# Altium project DM1097_R1M1E1.PrjPcb (part 11 of 12)

## Sheet DM1097_Connector_A.SchDoc: =project_title
size Tabloid; CompanyName: Luxonis Holding; DrawnBy: David Malovrh; Organization: Luxonis Holding; Address1: 1925 Harmony Park Drive; Address2: Westminster, CO; Address3: 80234; Address4: United States; DocumentNumber: D0000200; Revision: R1M1E1; SheetNumber: 3; SheetTotal: 17
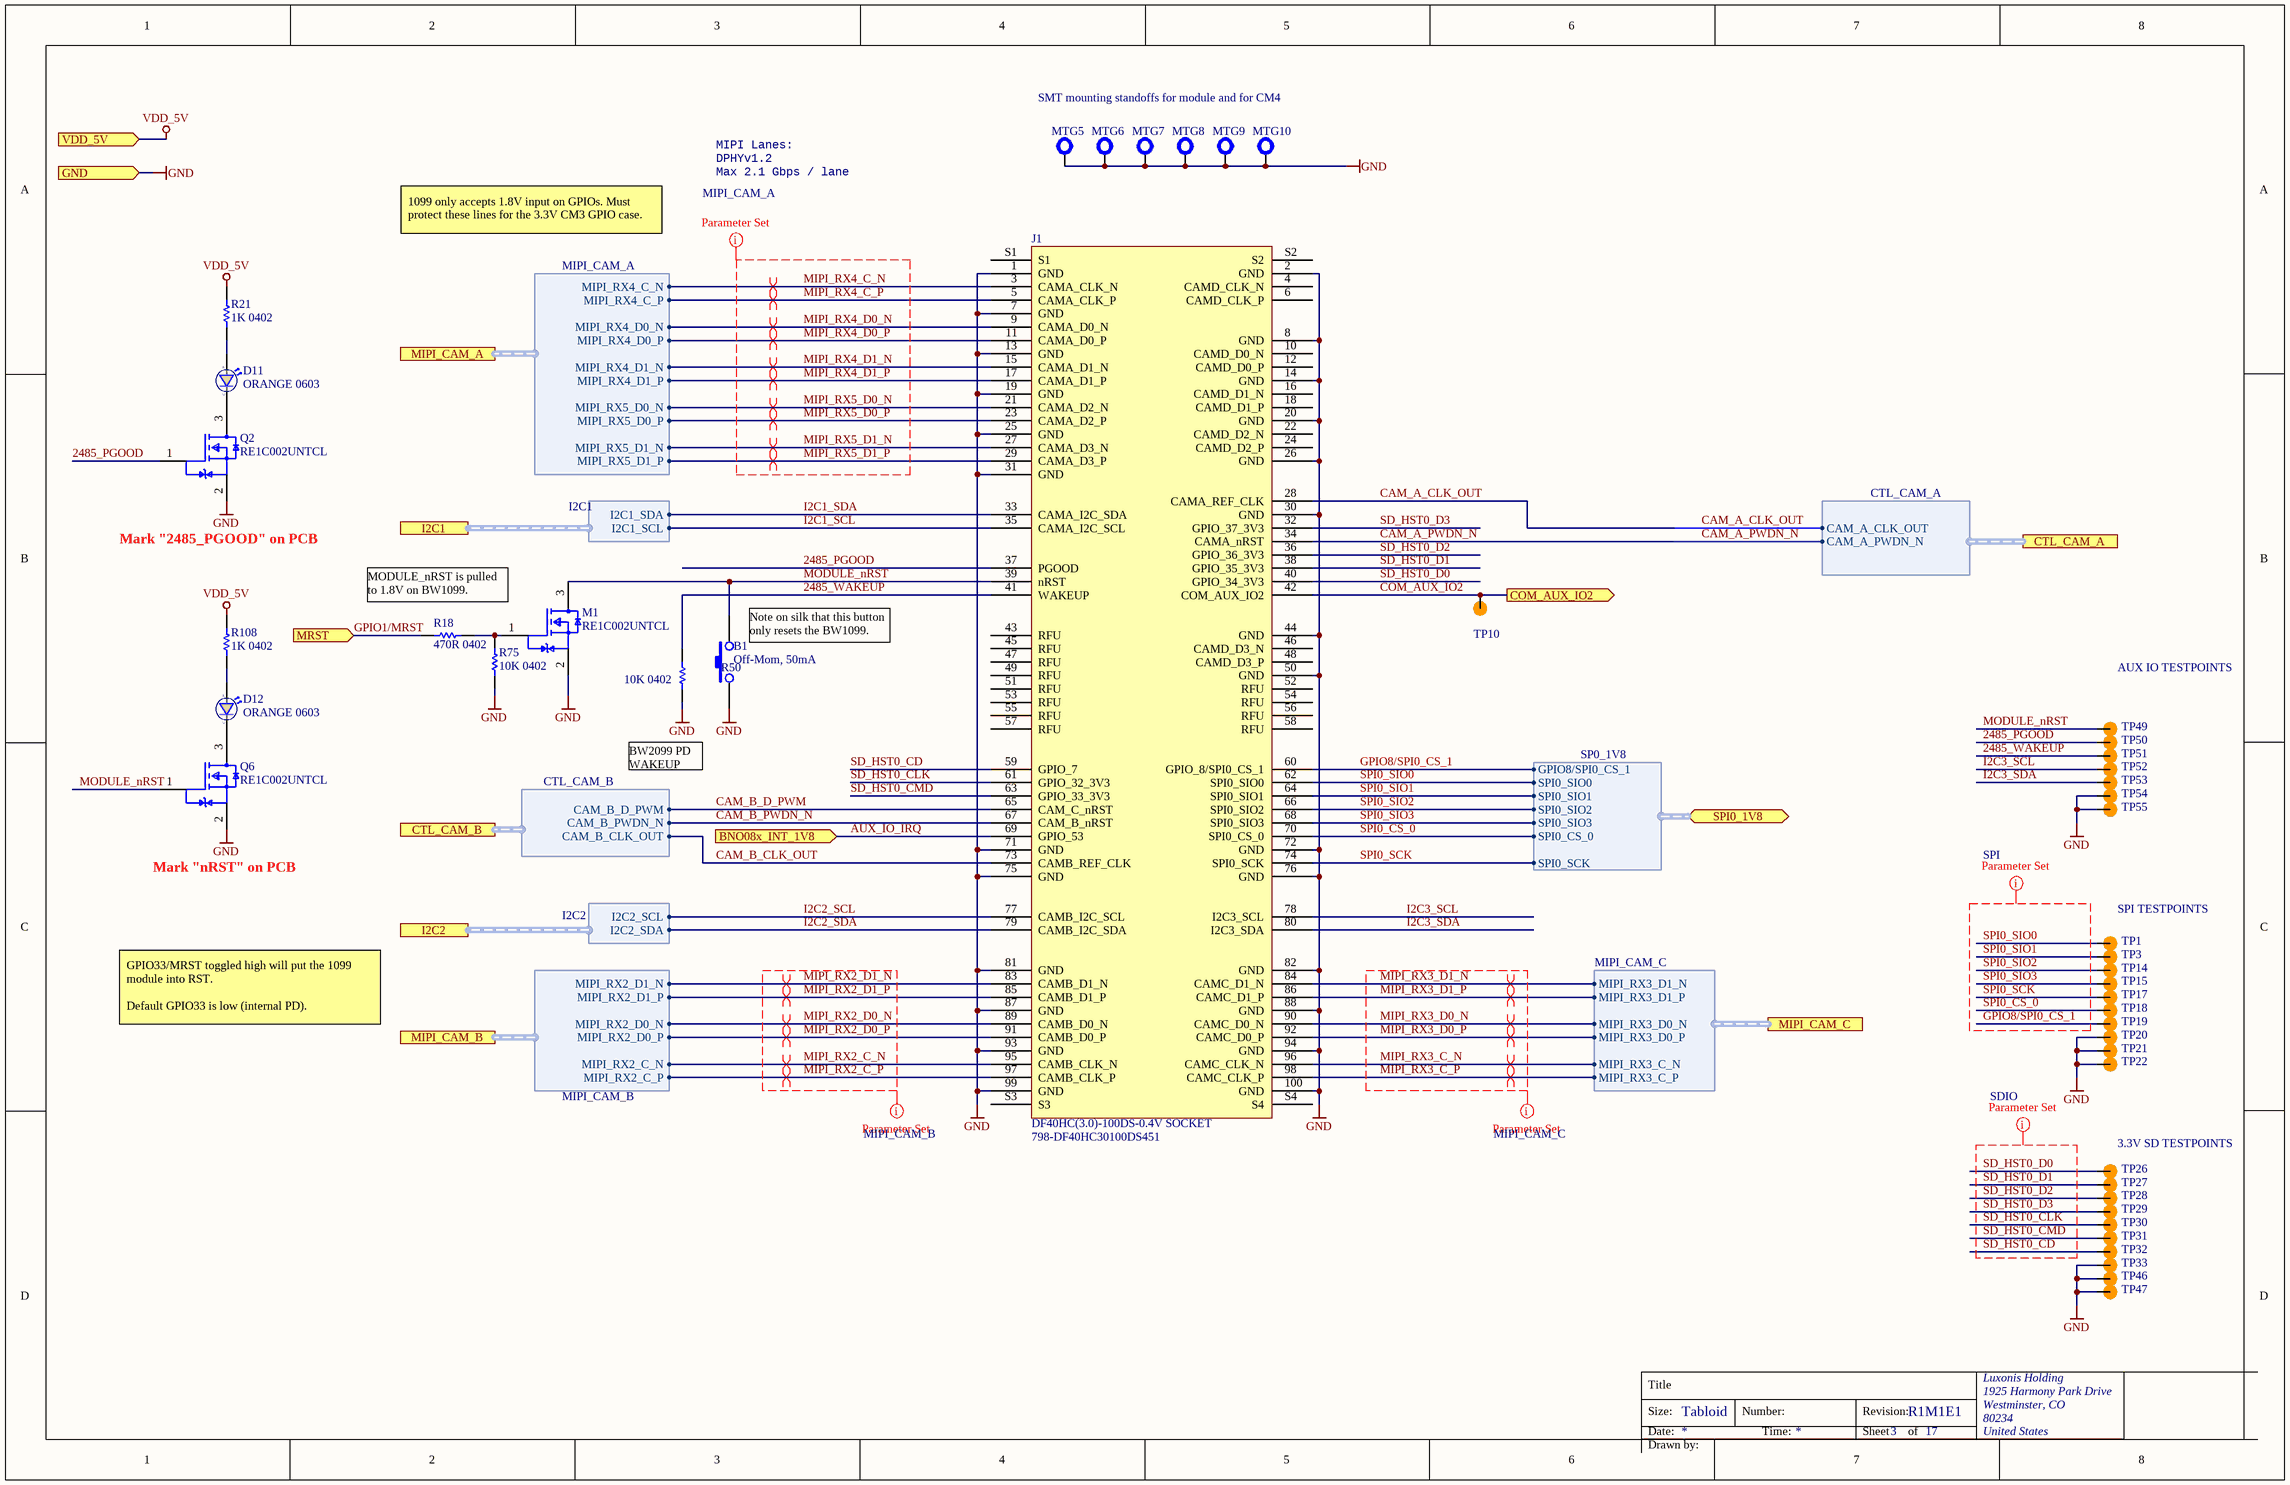
[diagram p15: DM1097_Connector_A.SchDoc]

### Parts
B1  Off-Mom, 50mA  [DTSM-32N-V]
D11  ORANGE 0603  [SML_D1xx8W]
D12  ORANGE 0603  [SML_D1xx8W]
J1  DF40HC(3.0)-100DS-0.4V SOCKET  Supplier Part Number 1: 798-DF40HC30100DS451  [DF40HC-3.0-100DS-0.4V_minpad]
M1  RE1C002UNTCL  [RE1C002UNTCL]
MTG5  M2, 3MM steel spacer on M2.5 mounting pad  [9774030943R]  (value not drawn)
MTG6  M2, 3MM steel spacer on M2.5 mounting pad  [9774030943R]  (value not drawn)
MTG7  M2, 3MM steel spacer on M2.5 mounting pad  [9774030943R]  (value not drawn)
MTG8  M2, 3MM steel spacer on M2.5 mounting pad  [9774030943R]  (value not drawn)
MTG9  M2, 3MM steel spacer on M2.5 mounting pad  [9774030943R]  (value not drawn)
MTG10  M2, 3MM steel spacer on M2.5 mounting pad  [9774030943R]  (value not drawn)
Q2  RE1C002UNTCL  [RE1C002UNTCL]
Q6  RE1C002UNTCL  [RE1C002UNTCL]
R18  470R 0402  [RESC0402(1005)_N]
R21  1K 0402  [RESC0402(1005)_L]
R50  10K 0402  [RESC0402(1005)_L]
R75  10K 0402  [RESC0402(1005)_N]
R108  1K 0402  [RESC0402(1005)_L]
TP1  TP100_200_NS  [TP100_200_NS]  (value not drawn)  (no BOM)
TP3  TP100_200_NS  [TP100_200_NS]  (value not drawn)  (no BOM)
TP10  TP100_200_NS  [TP100_200_NS]  (value not drawn)  (no BOM)
TP14  TP100_200_NS  [TP100_200_NS]  (value not drawn)  (no BOM)
TP15  TP100_200_NS  [TP100_200_NS]  (value not drawn)  (no BOM)
TP17  TP100_200_NS  [TP100_200_NS]  (value not drawn)  (no BOM)
TP18  TP100_200_NS  [TP100_200_NS]  (value not drawn)  (no BOM)
TP19  TP100_200_NS  [TP100_200_NS]  (value not drawn)  (no BOM)
TP20  TP100_200_NS  [TP100_200_NS]  (value not drawn)  (no BOM)
TP21  TP100_200_NS  [TP100_200_NS]  (value not drawn)  (no BOM)
TP22  TP100_200_NS  [TP100_200_NS]  (value not drawn)  (no BOM)
TP26  TP100_200_NS  [TP100_200_NS]  (value not drawn)  (no BOM)
TP27  TP100_200_NS  [TP100_200_NS]  (value not drawn)  (no BOM)
TP28  TP100_200_NS  [TP100_200_NS]  (value not drawn)  (no BOM)
TP29  TP100_200_NS  [TP100_200_NS]  (value not drawn)  (no BOM)
TP30  TP100_200_NS  [TP100_200_NS]  (value not drawn)  (no BOM)
TP31  TP100_200_NS  [TP100_200_NS]  (value not drawn)  (no BOM)
TP32  TP100_200_NS  [TP100_200_NS]  (value not drawn)  (no BOM)
TP33  TP100_200_NS  [TP100_200_NS]  (value not drawn)  (no BOM)
TP46  TP100_200_NS  [TP100_200_NS]  (value not drawn)  (no BOM)
TP47  TP100_200_NS  [TP100_200_NS]  (value not drawn)  (no BOM)
TP49  TP100_200_NS  [TP100_200_NS]  (value not drawn)  (no BOM)
TP50  TP100_200_NS  [TP100_200_NS]  (value not drawn)  (no BOM)
TP51  TP100_200_NS  [TP100_200_NS]  (value not drawn)  (no BOM)
TP52  TP100_200_NS  [TP100_200_NS]  (value not drawn)  (no BOM)
TP53  TP100_200_NS  [TP100_200_NS]  (value not drawn)  (no BOM)
TP54  TP100_200_NS  [TP100_200_NS]  (value not drawn)  (no BOM)
TP55  TP100_200_NS  [TP100_200_NS]  (value not drawn)  (no BOM)

### Ports
BNO08x_INT_1V8 (in), COM_AUX_IO2 (out), CTL_CAM_A (harness CTL_CAM_A), CTL_CAM_B (harness CTL_CAM_B), GND (in), I2C1 (harness I2C1), I2C2 (harness I2C2), MIPI_CAM_A (harness MIPI_CAM_A), MIPI_CAM_B (harness MIPI_CAM_B), MIPI_CAM_C (harness MIPI_CAM_C), MRST (in), SPI0_1V8 (bidir, harness SP0_1V8), VDD_5V (in)

### Harnesses
MIPI_CAM_B: MIPI_RX2_C_P, MIPI_RX2_C_N, MIPI_RX2_D0_P, MIPI_RX2_D0_N, MIPI_RX2_D1_P, MIPI_RX2_D1_N
MIPI_CAM_A: MIPI_RX4_C_P, MIPI_RX4_C_N, MIPI_RX4_D0_P, MIPI_RX4_D0_N, MIPI_RX4_D1_P, MIPI_RX4_D1_N, MIPI_RX5_D0_P, MIPI_RX5_D0_N, MIPI_RX5_D1_P, MIPI_RX5_D1_N
MIPI_CAM_C: MIPI_RX3_C_P, MIPI_RX3_C_N, MIPI_RX3_D0_P, MIPI_RX3_D0_N, MIPI_RX3_D1_P, MIPI_RX3_D1_N
I2C2: I2C2_SDA, I2C2_SCL
I2C1: I2C1_SDA, I2C1_SCL
CTL_CAM_A: CAM_A_PWDN_N, CAM_A_CLK_OUT
CTL_CAM_B: CAM_B_CLK_OUT, CAM_B_PWDN_N, CAM_B_D_PWM
SP0_1V8: SPI0_SIO1, SPI0_SIO2, SPI0_SIO3, GPIO8/SPI0_CS_1, SPI0_SIO0, SPI0_CS_0, SPI0_SCK

### Nets
GND: B1.1 J1.1(GND) J1.2(GND) J1.7(GND) J1.8(GND) J1.13(GND) J1.14(GND) J1.19(GND) J1.20(GND) J1.25(GND) J1.26(GND) J1.30(GND) J1.31(GND) J1.44(GND) J1.50(GND) J1.71(GND) J1.72(GND) J1.75(GND) J1.76(GND) J1.81(GND) J1.82(GND) J1.87(GND) J1.88(GND) J1.93(GND) J1.94(GND) J1.99(GND) J1.100(GND) M1.2(Source) MTG5.1 MTG6.1 MTG7.1 MTG8.1 MTG9.1 MTG10.1 Q2.2(Source) Q6.2(Source) R50.1 R75.1 TP20.1 TP21.1 TP22.1 TP33.1 TP46.1 TP47.1 TP54.1 TP55.1 ; port GND
VDD_5V: R21.2 R108.2 ; port VDD_5V
2485_PGOOD: J1.37(PGOOD) Q2.1(Gate) TP50.1
2485_WAKEUP: J1.41(WAKEUP) R50.2 TP51.1
AUX_IO_IRQ: J1.69(GPIO_53) ; port BNO08x_INT_1V8
CAM_A_CLK_OUT: J1.28(CAMA_REF_CLK) ; port CTL_CAM_A.CAM_A_CLK_OUT
CAM_A_PWDN_N: J1.34(CAMA_nRST) ; port CTL_CAM_A.CAM_A_PWDN_N
CAM_B_CLK_OUT: J1.73(CAMB_REF_CLK) ; port CTL_CAM_B.CAM_B_CLK_OUT
CAM_B_D_PWM: J1.65(CAM_C_nRST) ; port CTL_CAM_B.CAM_B_D_PWM
CAM_B_PWDN_N: J1.67(CAM_B_nRST) ; port CTL_CAM_B.CAM_B_PWDN_N
COM_AUX_IO2: J1.42(COM_AUX_IO2) TP10.1 ; port COM_AUX_IO2
GPIO1/MRST: R18.1 ; port MRST
GPIO8/SPI0_CS_1: J1.60(GPIO_8/SPI0_CS_1) TP19.1 ; port SPI0_1V8.GPIO8/SPI0_CS_1
I2C1_SCL: J1.35(CAMA_I2C_SCL) ; port I2C1.I2C1_SCL
I2C1_SDA: J1.33(CAMA_I2C_SDA) ; port I2C1.I2C1_SDA
I2C2_SCL: J1.77(CAMB_I2C_SCL) ; port I2C2.I2C2_SCL
I2C2_SDA: J1.79(CAMB_I2C_SDA) ; port I2C2.I2C2_SDA
I2C3_SCL: J1.78(I2C3_SCL) TP52.1
I2C3_SDA: J1.80(I2C3_SDA) TP53.1
MIPI_RX2_C_N: J1.95(CAMB_CLK_N) ; port MIPI_CAM_B.MIPI_RX2_C_N
MIPI_RX2_C_P: J1.97(CAMB_CLK_P) ; port MIPI_CAM_B.MIPI_RX2_C_P
MIPI_RX2_D0_N: J1.89(CAMB_D0_N) ; port MIPI_CAM_B.MIPI_RX2_D0_N
MIPI_RX2_D0_P: J1.91(CAMB_D0_P) ; port MIPI_CAM_B.MIPI_RX2_D0_P
MIPI_RX2_D1_N: J1.83(CAMB_D1_N) ; port MIPI_CAM_B.MIPI_RX2_D1_N
MIPI_RX2_D1_P: J1.85(CAMB_D1_P) ; port MIPI_CAM_B.MIPI_RX2_D1_P
MIPI_RX3_C_N: J1.96(CAMC_CLK_N) ; port MIPI_CAM_C.MIPI_RX3_C_N
MIPI_RX3_C_P: J1.98(CAMC_CLK_P) ; port MIPI_CAM_C.MIPI_RX3_C_P
MIPI_RX3_D0_N: J1.90(CAMC_D0_N) ; port MIPI_CAM_C.MIPI_RX3_D0_N
MIPI_RX3_D0_P: J1.92(CAMC_D0_P) ; port MIPI_CAM_C.MIPI_RX3_D0_P
MIPI_RX3_D1_N: J1.84(CAMC_D1_N) ; port MIPI_CAM_C.MIPI_RX3_D1_N
MIPI_RX3_D1_P: J1.86(CAMC_D1_P) ; port MIPI_CAM_C.MIPI_RX3_D1_P
MIPI_RX4_C_N: J1.3(CAMA_CLK_N) ; port MIPI_CAM_A.MIPI_RX4_C_N
MIPI_RX4_C_P: J1.5(CAMA_CLK_P) ; port MIPI_CAM_A.MIPI_RX4_C_P
MIPI_RX4_D0_N: J1.9(CAMA_D0_N) ; port MIPI_CAM_A.MIPI_RX4_D0_N
MIPI_RX4_D0_P: J1.11(CAMA_D0_P) ; port MIPI_CAM_A.MIPI_RX4_D0_P
MIPI_RX4_D1_N: J1.15(CAMA_D1_N) ; port MIPI_CAM_A.MIPI_RX4_D1_N
MIPI_RX4_D1_P: J1.17(CAMA_D1_P) ; port MIPI_CAM_A.MIPI_RX4_D1_P
MIPI_RX5_D0_N: J1.21(CAMA_D2_N) ; port MIPI_CAM_A.MIPI_RX5_D0_N
MIPI_RX5_D0_P: J1.23(CAMA_D2_P) ; port MIPI_CAM_A.MIPI_RX5_D0_P
MIPI_RX5_D1_N: J1.27(CAMA_D3_N) ; port MIPI_CAM_A.MIPI_RX5_D1_N
MIPI_RX5_D1_P: J1.29(CAMA_D3_P) ; port MIPI_CAM_A.MIPI_RX5_D1_P
MODULE_nRST: B1.2 J1.39(nRST) M1.3(Drain) Q6.1(Gate) TP49.1
SD_HST0_CD: J1.59(GPIO_7) TP32.1
SD_HST0_CLK: J1.61(GPIO_32_3V3) TP30.1
SD_HST0_CMD: J1.63(GPIO_33_3V3) TP31.1
SD_HST0_D0: J1.40(GPIO_34_3V3) TP26.1
SD_HST0_D1: J1.38(GPIO_35_3V3) TP27.1
SD_HST0_D2: J1.36(GPIO_36_3V3) TP28.1
SD_HST0_D3: J1.32(GPIO_37_3V3) TP29.1
SPI0_CS_0: J1.70(SPI0_CS_0) TP18.1 ; port SPI0_1V8.SPI0_CS_0
SPI0_SCK: J1.74(SPI0_SCK) TP17.1 ; port SPI0_1V8.SPI0_SCK
SPI0_SIO0: J1.62(SPI0_SIO0) TP1.1 ; port SPI0_1V8.SPI0_SIO0
SPI0_SIO1: J1.64(SPI0_SIO1) TP3.1 ; port SPI0_1V8.SPI0_SIO1
SPI0_SIO2: J1.66(SPI0_SIO2) TP14.1 ; port SPI0_1V8.SPI0_SIO2
SPI0_SIO3: J1.68(SPI0_SIO3) TP15.1 ; port SPI0_1V8.SPI0_SIO3
NetD11_1: D11.1(C) Q2.3(Drain)
NetD11_2: D11.2(A) R21.1
NetD12_1: D12.1(C) Q6.3(Drain)
NetD12_2: D12.2(A) R108.1
NetM1_1: M1.1(Gate) R18.2 R75.2

Not connected (* = marked no-connect by the designer): J1 4(CAMD_CLK_N) 6(CAMD_CLK_P) 10(CAMD_D0_N) 12(CAMD_D0_P) 16(CAMD_D1_N) 18(CAMD_D1_P) 22(CAMD_D2_N) 24(CAMD_D2_P) 43(RFU) 45(RFU) 46(CAMD_D3_N) 47(RFU) 48(CAMD_D3_P) 49(RFU) 51(RFU) 52(RFU) 53(RFU) 54(RFU) 55(RFU) 56(RFU) 57(RFU) 58(RFU) S1 S2 S3 S4

### Layout directives
net class MIPI_CAM_C; rule Matched Net Lengths [Delay Tolerance = 1ps]: MIPI_RX3_C_N, MIPI_RX3_C_P, MIPI_RX3_D0_N, MIPI_RX3_D0_P, MIPI_RX3_D1_N, MIPI_RX3_D1_P
differential pair; differential pair class 100ohm: MIPI_RX2_C_N, MIPI_RX2_C_P, MIPI_RX2_D0_N, MIPI_RX2_D0_P, MIPI_RX2_D1_N, MIPI_RX2_D1_P, MIPI_RX3_C_N, MIPI_RX3_C_P, MIPI_RX3_D0_N, MIPI_RX3_D0_P, MIPI_RX3_D1_N, MIPI_RX3_D1_P, MIPI_RX4_C_N, MIPI_RX4_C_P, MIPI_RX4_D0_N, MIPI_RX4_D0_P, MIPI_RX4_D1_N, MIPI_RX4_D1_P, MIPI_RX5_D0_N, MIPI_RX5_D0_P, MIPI_RX5_D1_N, MIPI_RX5_D1_P
net class SDIO; rule Matched Net Lengths [Delay Tolerance = 10ps]: SD_HST0_CD, SD_HST0_CLK, SD_HST0_CMD, SD_HST0_D0, SD_HST0_D1, SD_HST0_D2, SD_HST0_D3
net class SPI: GPIO8/SPI0_CS_1, SPI0_CS_0, SPI0_SCK, SPI0_SIO0, SPI0_SIO1, SPI0_SIO2, SPI0_SIO3
net class MIPI_CAM_B; rule Matched Net Lengths [Delay Tolerance = 1ps]: MIPI_RX2_C_N, MIPI_RX2_C_P, MIPI_RX2_D0_N, MIPI_RX2_D0_P, MIPI_RX2_D1_N, MIPI_RX2_D1_P
net class MIPI_CAM_A; rule Matched Net Lengths [Delay Tolerance = 1ps]: MIPI_RX4_C_N, MIPI_RX4_C_P, MIPI_RX4_D0_N, MIPI_RX4_D0_P, MIPI_RX4_D1_N, MIPI_RX4_D1_P, MIPI_RX5_D0_N, MIPI_RX5_D0_P, MIPI_RX5_D1_N, MIPI_RX5_D1_P

### Notes on the sheet
- MIPI Lanes:
- DPHYv1.2
- SMT mounting standoffs for module and for CM4
- 1099 only accepts 1.8V input on GPIOs. Must protect these lines for the 3.3V CM3 GPIO case.
- Max 2.1 Gbps / lane
- Mark "2485_PGOOD" on PCB
- MODULE_nRST is pulled to 1.8V on BW1099.
- (near B1) Note on silk that this button only resets the BW1099.
- AUX IO TESTPOINTS
- BW2099 PD
  WAKEUP
- Mark "nRST" on PCB
- SPI TESTPOINTS
- GPIO33/MRST toggled high will put the 1099 module into RST.
  Default GPIO33 is low (internal PD).
- 3.3V SD TESTPOINTS
- Title
- Size:
- Date:
- Tabloid
- Number:
- Time:
- Revision:
- Sheet
- of
- Drawn by:

### Library data of the parts
B1 = DTSM-32N-V: SWITCH TACTILE SMT 3.5mm * 6mm , brown 160gf; Manufacturer 1: Diptronics; Manufacturer Part Number 1: DTSM-32N-V-T/R; Supplier 1: Mouser; Stock 1: 3199; Pricing 1: 1=0.38000, 10=0.38000, 50=0.31000, 100=0.28200, 500=0.25600, 1000=0.23600, 1600=0.20900, 4800=0.18800, 9600=0.17300, 10000=0.17300, 24000=0.16100 (USD); RoHS: Yes; Min Operating Temperature: -30°C; Max Operating Temperature: 80°C; Length: 6mm; Height: 5mm; Width: 3.5mm; ComponentLink1URL: https://datasheet.ciiva.com/29188/708548-da-01-en-tastschalter-smd-dtsm-32n-v-tr-1600st-29188823.pdf?src-supplier=Conrad; ComponentLink1Description: https://datasheet.ciiva.com/29188/708548-da-01-en-tastschalter-smd-dtsm-32n-v-tr-1600st-29188823.pdf?src-supplier=Conrad; Supplier Part Number 1: 113-DTSM32NVTR
D11 D12 = SML-D12D8WT86: LED ORANGE DIFFUSED 0603 SMD Orange 605nm LED Indication - Discrete 2.2V 0603 (1608 Metric); Manufacturer 1: Rohm; Lens Color: White; Lens Style: Diffused,Colorless,Rectangular; Number of LEDs: 1; Viewing Angle: 160°; Forward Current: 20mA; Luminous Intensity: 100mcd; Supplier 1: Digi-Key; Stock 1: 29355; Pricing 1: 1=0.33000, 10=0.23900, 100=0.11340, 500=0.07560, 1000=0.05922 (USD); RoHS: Yes; Mount: Surface Mount; Case/Package: 0603; Number of Pins: 2; Color: Orange; Case Code (Metric): 1608; Case Code (Imperial): 0603; Min Operating Temperature: -40°C; Max Operating Temperature: 85°C; Dominant Wavelength: 605nm; Forward Voltage: 2.2V; Package Quantity: 1; Packaging: Tape and Reel; Illumination Color: Orange; Test Current: 20mA; Lens Transparency: Diffused; Wavelength: 605nm; Length: 1.6mm; Height: 0.65mm; Width: 0.8mm; Radiation Hardening: No; REACH SVHC: Unknown; Lead Free: Lead Free; ComponentLink1URL: https://datasheet.ciiva.com/2115/sml-d1-2115577.pdf?src-supplier=Digi-Key; ComponentLink1Description: https://datasheet.ciiva.com/2115/sml-d1-2115577.pdf?src-supplier=Digi-Key; ComponentLink2URL: https://datasheet.ciiva.com/2115/sml-d1-2115578.pdf?src-supplier=Digi-Key; ComponentLink2Description: https://datasheet.ciiva.com/2115/sml-d1-2115578.pdf?src-supplier=Digi-Key; ComponentLink3URL: https://datasheet.ciiva.com/3161/sml-d1-3161418.pdf?src-supplier=Avnet; ComponentLink3Description: https://datasheet.ciiva.com/3161/sml-d1-3161418.pdf?src-supplier=Avnet; ComponentLink4URL: https://datasheet.ciiva.com/16387/sml-d1-16387850.pdf?src-supplier=Future+Electronics; ComponentLink4Description: https://datasheet.ciiva.com/16387/sml-d1-16387850.pdf?src-supplier=Future+Electronics; ComponentLink5URL: https://datasheet.ciiva.com/2115/sml-d1-2115579.pdf?src-supplier=Digi-Key; ComponentLink5Description: https://datasheet.ciiva.com/2115/sml-d1-2115579.pdf?src-supplier=Digi-Key; ComponentLink6URL: https://datasheet.ciiva.com/17419/sml-d1-17419886.pdf?src-supplier=Avnet+Europe; ComponentLink6Description: https://datasheet.ciiva.com/17419/sml-d1-17419886.pdf?src-supplier=Avnet+Europe; Supplier Part Number 1: 511-1577-1-ND; Manufacturer Part Number 1: SML-D12D8WT86
J1 = BW2099_SCKT_Conn_A: Conn Board to Board RCP 100 POS 0.4mm Solder ST SMD T/R; Manufacturer 1: Hirose; Manufacturer Part Number 1: DF40HC(3.0)-100DS-0.4V(51; Connector Type: Receptacle; Number of Positions: 100; Pitch: 0.016inch; Supplier 1: Mouser; RoHS: Yes; Category: Headers and Wire Housings; Stock 1: 4724; Pricing 1: 1=2.50000, 10=2.15000, 50=2.15000, 100=2.00000, 1000=1.45000, 10000=1.29000 (USD); Mount: Surface Mount; Contact Plating: Gold; Package Quantity: 3000; Packaging: Tape and Reel; Number of Rows: 2; ComponentLink1URL: https://datasheet.ciiva.com/13559/ed-df40-20140305-13559540.pdf?src-supplier=Mouser; ComponentLink1Description: https://datasheet.ciiva.com/13559/ed-df40-20140305-13559540.pdf?src-supplier=Mouser; ComponentLink2URL: https://datasheet.ciiva.com/18562/ed-df40-20140305-18562462.pdf?src-supplier=Digi-Key; ComponentLink2Description: https://datasheet.ciiva.com/18562/ed-df40-20140305-18562462.pdf?src-supplier=Digi-Key
M1 Q2 Q6 = RE1C002UNTCL: as Q5 on sheet DM1097_Power_Supply; Supplier 1: Digi-Key; Manufacturer Part Number 1: RE1C002UNTCL; Stock 1: 868886; Pricing 1: 1=0.20000, 10=0.18200, 100=0.09930, 500=0.06112, 1000=0.04167 (USD); RoHS: Yes; Mount: Surface Mount; Case/Package: SOT-89; Packaging: Tape and Reel; Lead Free: Lead Free; ComponentLink1URL: http://www.mouser.com/ds/2/348/re1c002untcl-e-1018231.pdf?src-supplier=Mouser; ComponentLink1Description: http://www.mouser.com/ds/2/348/re1c002untcl-e-1018231.pdf?src-supplier=Mouser; ComponentLink2URL: http://rohmfs.rohm.com/en/techdata_basic/transistor/taping/EMT3_TL_taping.pdf?src-supplier=Digi-Key; ComponentLink2Description: http://rohmfs.rohm.com/en/techdata_basic/transistor/taping/EMT3_TL_taping.pdf?src-supplier=Digi-Key; ComponentLink3URL: http://rohmfs.rohm.com/en/products/databook/datasheet/discrete/transistor/mosfet/re1c002un.pdf?src-supplier=Avnet; ComponentLink3Description: http://rohmfs.rohm.com/en/products/databook/datasheet/discrete/transistor/mosfet/re1c002un.pdf?src-supplier=Avnet; ComponentLink4URL: https://www.rohm.com/datasheet/RE1C002UN/re1c002untcl-e?src-supplier=Digi-Key; ComponentLink4Description: https://www.rohm.com/datasheet/RE1C002UN/re1c002untcl-e?src-supplier=Digi-Key; ComponentLink5URL: http://www.farnell.com/datasheets/2704376.pdf?src-supplier=Newark; ComponentLink5Description: http://www.farnell.com/datasheets/2704376.pdf?src-supplier=Newark; Supplier Part Number 1: RE1C002UNTCLCT-ND; ComponentLink6URL: http://www.farnell.com/datasheets/2704376.pdf?src-supplier=Farnell; ComponentLink6Description: http://www.farnell.com/datasheets/2704376.pdf?src-supplier=Farnell; ComponentLink7URL: http://www.farnell.com/datasheets/2704376.pdf?src-supplier=Element14; ComponentLink7Description: http://www.farnell.com/datasheets/2704376.pdf?src-supplier=Element14; Supplier 2: Digi-Key; Manufacturer 2: Vishay Siliconix; Manufacturer Part Number 2: SI1062X-T1-GE3; Category: MOSFETs; Stock 2: 28076; Pricing 2: 1=0,47000, 10=0,33100, 25=0,30800, 100=0,16720, 500=0,13640, 1000=0,10120 (USD); Number of Pins: 3; Weight: 0.001058oz; Min Operating Temperature: -55°C; Max Operating Temperature: 150°C; Package Quantity: 3000; Drain to Source Breakdown Voltage: 20V; Number of Channels: 1; Series: TrenchFET®; Drain-source On Resistance-Max: 420mR; REACH SVHC: No SVHC; RoHS Compliant: Yes; ComponentLink8URL: https://datasheet.ciiva.com/6376/si1062x-6376310.pdf?src-supplier=Digi-Key; ComponentLink8Description: https://datasheet.ciiva.com/6376/si1062x-6376310.pdf?src-supplier=Digi-Key; ComponentLink9URL: https://datasheet.ciiva.com/24011/si1062x-256537-24011195.pdf?src-supplier=Mouser; ComponentLink9Description: https://datasheet.ciiva.com/24011/si1062x-256537-24011195.pdf?src-supplier=Mouser; ComponentLink10URL: https://datasheet.ciiva.com/6376/si1062x-6376251.pdf?src-supplier=Digi-Key; ComponentLink10Description: https://datasheet.ciiva.com/6376/si1062x-6376251.pdf?src-supplier=Digi-Key; Supplier 3: Digi-Key; Supplier Part Number 2: SI1062X-T1-GE3CT-ND; Supplier Part Number 3: SI1062X-T1-GE3TR-ND
MTG5-MTG10 = 9774030943R: Spacers/Standoffs; Manufacturer 1: Wurth Electronics; Supplier 1: Digi-Key; Manufacturer Part Number 1: 9774030943R; RoHS: Yes; Category: Spacers, Standoffs; Stock 1: 354; Pricing 1: 1=0,81000, 10=0,75600, 50=0,70200, 100=0,62100 (USD); ComponentLink1URL: https://katalog.we-online.de/em/datasheet/9774030943.pdf?src-supplier=Digi-Key; ComponentLink1Description: https://katalog.we-online.de/em/datasheet/9774030943.pdf?src-supplier=Digi-Key; ComponentLink2URL: http://www.farnell.com/datasheets/2305586.pdf?src-supplier=Newark; ComponentLink2Description: http://www.farnell.com/datasheets/2305586.pdf?src-supplier=Newark; ComponentLink3URL: http://www.farnell.com/datasheets/2305586.pdf?src-supplier=Element14; ComponentLink3Description: http://www.farnell.com/datasheets/2305586.pdf?src-supplier=Element14; Supplier 2: Newark; Supplier 3: Mouser; Supplier 4: Farnell; Supplier 5: Element14; Supplier Part Number 3: 710-9774030943R; Supplier Part Number 2: 22AC5240; Supplier Part Number 1: 732-10940-1-ND; Supplier Part Number 4: 2766296; Supplier Part Number 5: 2766296
R18 = CRCW0402470RFKED: RES SMD 470 OHM 1% 1/16W 0402; Manufacturer 1: Vishay; Temperature Coefficient: 100ppm/°C; Power Rating: 63mW; Voltage Rating: 50V; Supplier 1: Digi-Key; Manufacturer Part Number 1: CRCW0402470RFKED; Stock 1: 9199; Pricing 1: 1=0.10000, 10=0.03800, 100=0.01540, 1000=0.00690, 2500=0.00599, 5000=0.00495 (USD); RoHS: Yes; Case/Package: 0402; Weight: 2.3E-05oz; Case Code (Imperial): 0402; Case Code (Metric): 1005; Min Operating Temperature: -55°C; Max Operating Temperature: 155°C; Packaging: Tape and Reel; Resistance: 470R; Tolerance: 1%; Composition: Thick Film; Voltage Rating (DC): 50V; Termination: SMD/SMT; Military Standard: Not; Length: 1mm; Height: 0.35mm; Width: 0.5mm; Depth: 0.5mm; Lead Free: Lead Free; ComponentLink1URL: https://datasheet.ciiva.com/11811/0900766b80d98824-11811416.pdf?src-supplier=RSComponents; ComponentLink1Description: https://datasheet.ciiva.com/11811/0900766b80d98824-11811416.pdf?src-supplier=RSComponents; Supplier 2: Newark; Supplier Part Number 1: 541-470LCT-ND; Supplier Part Number 2: 26W9133; Mount: Surface Mount; Contact Plating: Tin; Number of Terminations: 2; Package Quantity: 10; Max Power Dissipation: 63mW; Features: Automotive AEC-Q200; Radiation Hardening: No; REACH SVHC: Unknown; ComponentLink2URL: https://datasheet.ciiva.com/16764/70201119-16764886.pdf?src-supplier=Allied+Electronics; ComponentLink2Description: https://datasheet.ciiva.com/16764/70201119-16764886.pdf?src-supplier=Allied+Electronics; ComponentLink3URL: https://datasheet.ciiva.com/28613/1720486-28613479.pdf?src-supplier=Element14; ComponentLink3Description: https://datasheet.ciiva.com/28613/1720486-28613479.pdf?src-supplier=Element14; ComponentLink4URL: https://datasheet.ciiva.com/3256/dcrcwe3-3256553.pdf?src-supplier=Avnet; ComponentLink4Description: https://datasheet.ciiva.com/3256/dcrcwe3-3256553.pdf?src-supplier=Avnet; ComponentLink5URL: https://datasheet.ciiva.com/7777/1720486-7777243.pdf?src-supplier=Element14; ComponentLink5Description: https://datasheet.ciiva.com/7777/1720486-7777243.pdf?src-supplier=Element14; ComponentLink6URL: https://datasheet.ciiva.com/8336/dcrcwe3-8336715.pdf?src-supplier=Avnet; ComponentLink6Description: https://datasheet.ciiva.com/8336/dcrcwe3-8336715.pdf?src-supplier=Avnet; ComponentLink7URL: https://datasheet.ciiva.com/7777/1697337-7777244.pdf?src-supplier=Element14; ComponentLink7Description: https://datasheet.ciiva.com/7777/1697337-7777244.pdf?src-supplier=Element14; ComponentLink8URL: https://datasheet.ciiva.com/2463/dcrcwe3-2463085.pdf?src-supplier=Digi-Key; ComponentLink8Description: https://datasheet.ciiva.com/2463/dcrcwe3-2463085.pdf?src-supplier=Digi-Key; ComponentLink9URL: https://datasheet.ciiva.com/16362/dcrcwe3-16362109.pdf?src-supplier=Future+Electronics; ComponentLink9Description: https://datasheet.ciiva.com/16362/dcrcwe3-16362109.pdf?src-supplier=Future+Electronics; ComponentLink10URL: https://datasheet.ciiva.com/16882/dcrcwe3-16882493.pdf?src-supplier=Avnet+Europe; ComponentLink10Description: https://datasheet.ciiva.com/16882/dcrcwe3-16882493.pdf?src-supplier=Avnet+Europe; ComponentLink11URL: https://datasheet.ciiva.com/2463/dcrcwe3-2463086.pdf?src-supplier=Digi-Key; ComponentLink11Description: https://datasheet.ciiva.com/2463/dcrcwe3-2463086.pdf?src-supplier=Digi-Key; ComponentLink12URL: https://datasheet.ciiva.com/2463/dcrcwe3-2463087.pdf?src-supplier=Digi-Key; ComponentLink12Description: https://datasheet.ciiva.com/2463/dcrcwe3-2463087.pdf?src-supplier=Digi-Key
R21 R108 = RC0402FR-071KL: as R30 on sheet DM1097_Power_Supply; RoHS: Yes; Number of Pins: 2; Case Code (Imperial): 0402; Case Code (Metric): 1005; Min Operating Temperature: -55°C; Max Operating Temperature: 155°C; Packaging: Tape and Reel; Composition: Thick Film; Voltage Rating: 50V; Military Standard: Not; Termination: SMD/SMT; Length: 1mm; Height: 0.32mm; Width: 0.5mm; Depth: 0.5mm; Lead Free: Lead Free; REACH SVHC: Unknown; ComponentLink1URL: https://datasheet.ciiva.com/11819/0900766b80c66297-11819477.pdf?src-supplier=RSComponents; ComponentLink1Description: https://datasheet.ciiva.com/11819/0900766b80c66297-11819477.pdf?src-supplier=RSComponents; ComponentLink2URL: https://datasheet.ciiva.com/12666/pyu-rc0402-51-rohs-l-6-r-12666741.pdf?src-supplier=Mouser; ComponentLink2Description: https://datasheet.ciiva.com/12666/pyu-rc0402-51-rohs-l-6-r-12666741.pdf?src-supplier=Mouser; ComponentLink3URL: https://datasheet.ciiva.com/17063/pyu-rc0402-51-rohs-l-6-r-17063193.pdf?src-supplier=Future+Electronics; ComponentLink3Description: https://datasheet.ciiva.com/17063/pyu-rc0402-51-rohs-l-6-r-17063193.pdf?src-supplier=Future+Electronics; ComponentLink4URL: https://datasheet.ciiva.com/22747/1018594-22747513.pdf?src-supplier=Element14; ComponentLink4Description: https://datasheet.ciiva.com/22747/1018594-22747513.pdf?src-supplier=Element14; ComponentLink5URL: https://datasheet.ciiva.com/7849/1018594-7849869.pdf?src-supplier=Element14; ComponentLink5Description: https://datasheet.ciiva.com/7849/1018594-7849869.pdf?src-supplier=Element14; ComponentLink6URL: https://datasheet.ciiva.com/7983/1018594-7983502.pdf?src-supplier=Element14; ComponentLink6Description: https://datasheet.ciiva.com/7983/1018594-7983502.pdf?src-supplier=Element14; ComponentLink7URL: https://datasheet.ciiva.com/7849/1018594-7849871.pdf?src-supplier=Element14; ComponentLink7Description: https://datasheet.ciiva.com/7849/1018594-7849871.pdf?src-supplier=Element14; Supplier 1: Digi-Key; Manufacturer Part Number 1: RC0402FR-071KL; Stock 1: 60695854; Pricing 1: 1=0.10000, 10=0.01600, 100=0.00670, 1000=0.00301, 2500=0.00261, 5000=0.00215 (USD); Case/Package: 0402; Tolerance: 1%; Supplier Part Number 1: 311-1.00KLRCT-ND
R50 R75 = RC0402FR-1310KL: as R33 on sheet DM1097_LEFT_OV9282; ComponentLink1URL: https://datasheet.ciiva.com/16940/pyu-rc0402-51-rohs-l-6-16940293.pdf?src-supplier=Avnet+Europe; ComponentLink1Description: https://datasheet.ciiva.com/16940/pyu-rc0402-51-rohs-l-6-16940293.pdf?src-supplier=Avnet+Europe; ComponentLink2URL: https://datasheet.ciiva.com/28386/pyu-rc0402-51-rohs-l-6-28386855.pdf?src-supplier=Avnet+Europe; ComponentLink2Description: https://datasheet.ciiva.com/28386/pyu-rc0402-51-rohs-l-6-28386855.pdf?src-supplier=Avnet+Europe; ComponentLink3URL: https://datasheet.ciiva.com/16740/pyu-rc0402-51-rohs-l-6-r-16740602.pdf?src-supplier=Future+Electronics; ComponentLink3Description: https://datasheet.ciiva.com/16740/pyu-rc0402-51-rohs-l-6-r-16740602.pdf?src-supplier=Future+Electronics; ComponentLink4URL: https://datasheet.ciiva.com/8891/pyu-rc0402-51-rohs-l-6-8891339.pdf?src-supplier=Avnet; ComponentLink4Description: https://datasheet.ciiva.com/8891/pyu-rc0402-51-rohs-l-6-8891339.pdf?src-supplier=Avnet; ComponentLink5URL: https://datasheet.ciiva.com/5557/pyu-rc0402-51-rohs-l-6-r-5557997.pdf?src-supplier=Mouser; ComponentLink5Description: https://datasheet.ciiva.com/5557/pyu-rc0402-51-rohs-l-6-r-5557997.pdf?src-supplier=Mouser; ComponentLink6URL: https://datasheet.ciiva.com/7983/1018594-7983533.pdf?src-supplier=Element14; ComponentLink6Description: https://datasheet.ciiva.com/7983/1018594-7983533.pdf?src-supplier=Element14; Supplier 1: Newark; Manufacturer Part Number 1: RC0402FR-1310KL; Stock 1: 62239; Pricing 1: 1=0.10000, 25=0.01200, 100=0.00400, 250=0.00400, 500=0.00300, 1000=0.00300 (USD); RoHS: Yes; Case/Package: 0402; Number of Pins: 2; Contact Plating: Tin,Matte,Lead; Case Code (Imperial): 0402; Case Code (Metric): 1005; Min Operating Temperature: -55°C; Max Operating Temperature: 155°C; Tolerance: 1%; Composition: Thick Film; Packaging: Tape and Reel; Termination: SMD/SMT; Military Standard: Not; Voltage Rating (DC): 50V; Working Voltage: 50V; Number of Terminations: 2; Length: 1mm; Depth: 0.5mm; Radiation Hardening: No; REACH SVHC: No SVHC; Lead Free: Lead Free; Supplier Part Number 1: 67R9960; Supplier 2: Future Electronics; Supplier 3: Mouser; Supplier 4: Element14; Supplier Part Number 2: RC0402FR-1310KL-CUTT; Supplier Part Number 3: 603-RC0402FR-1310KL; Supplier Part Number 4: 1799235
TP1 TP3 TP10 TP14 TP15 TP17-TP22 TP26-TP33 TP46 TP47 TP49-TP55 = TEST_POINT